# EAGLE design led-heart (EAGLE 9.1.3)
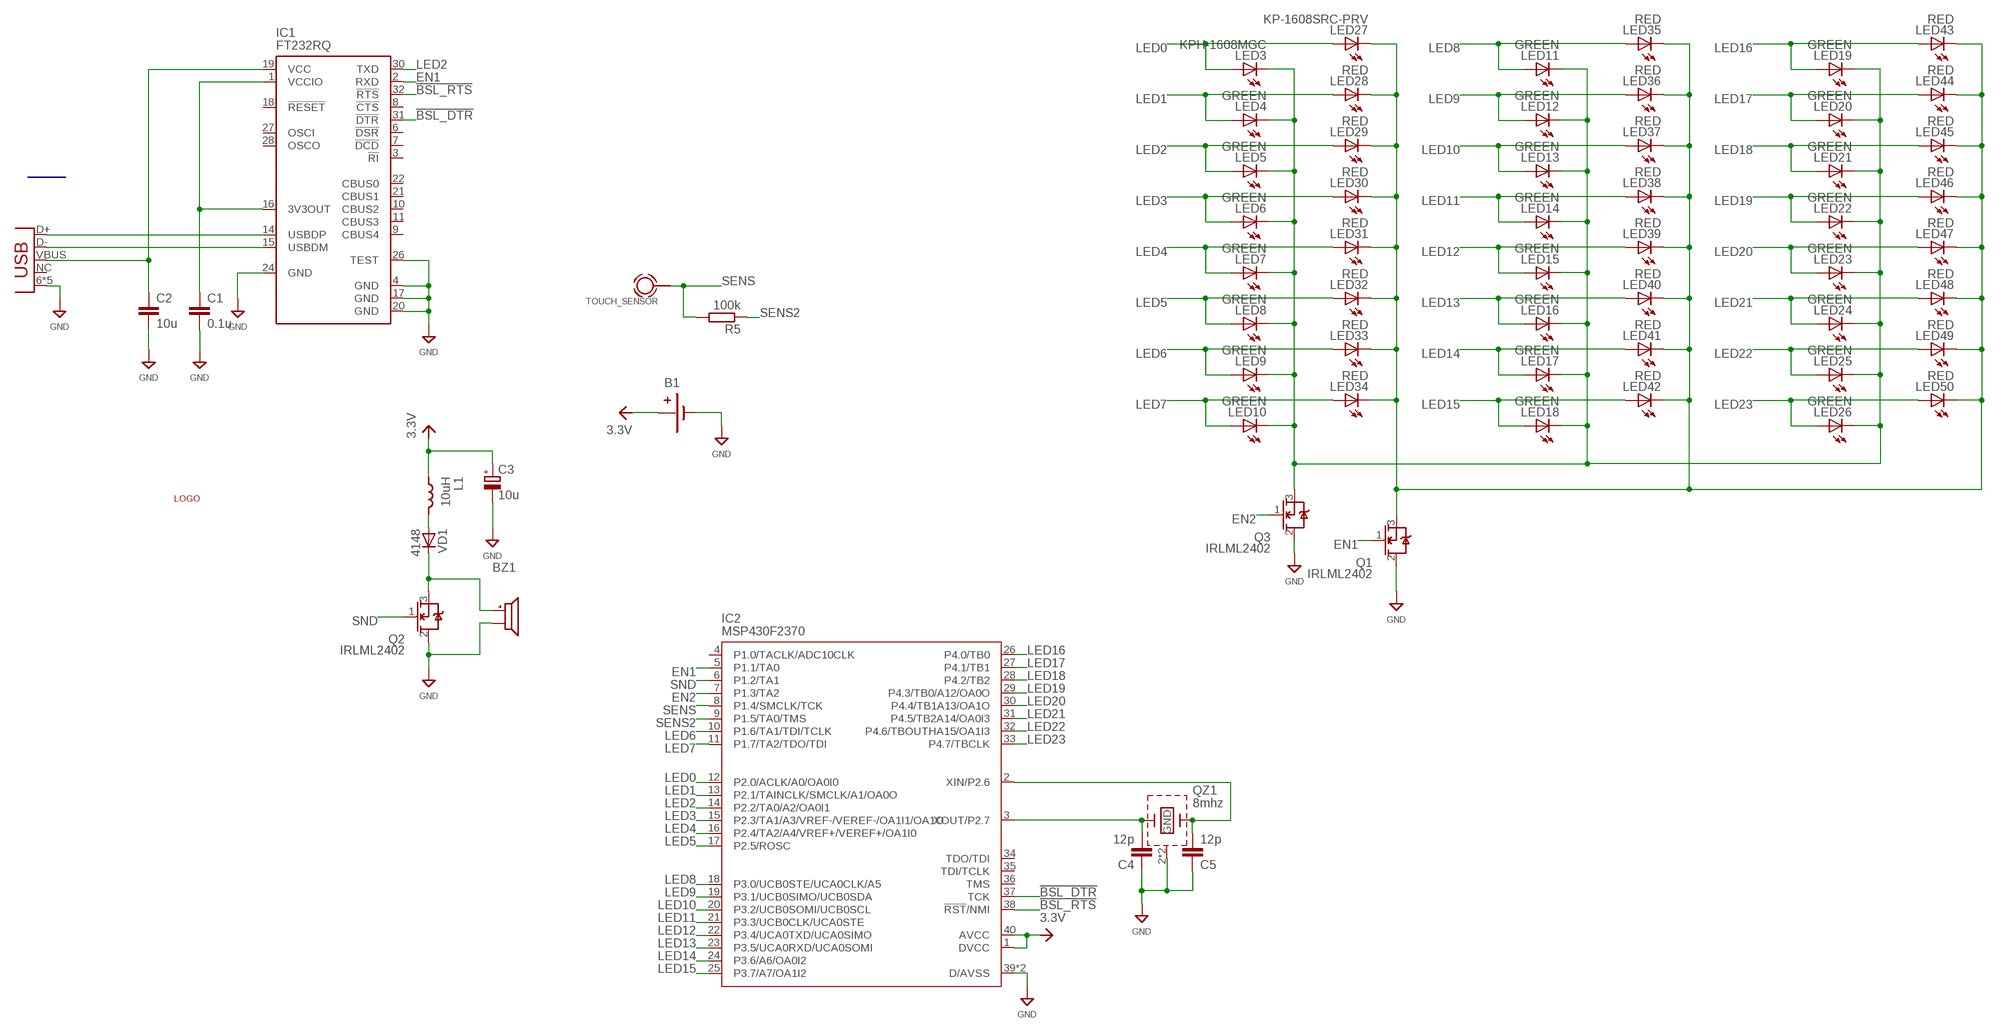
[diagram p0: schematic, sheet 1]

## Parts
B1  CR2032  [CR2032]
BZ1  BUZZERHYG2575  [HYG7525]
C1  0.1u  CAP0402  [R0402]
C2  10u  CAP0603  [R0603]
C3  10u  CPOL-EUSMCA  [SMC_A]
C4  12p  CAP0402  [R0402]
C5  12p  CAP0402  [R0402]
IC1  FT232RQ  [QFN32]
IC2  MSP430F2370  [QFN40-6X6]
L1  10uH  L-1812  [C1812]
LED3  KPH-1608MGC  LED0603  [LED0603]
LED4  GREEN  LED0603  [LED0603]
LED5  GREEN  LED0603  [LED0603]
LED6  GREEN  LED0603  [LED0603]
LED7  GREEN  LED0603  [LED0603]
LED8  GREEN  LED0603  [LED0603]
LED9  GREEN  LED0603  [LED0603]
LED10  GREEN  LED0603  [LED0603]
LED11  GREEN  LED0603  [LED0603]
LED12  GREEN  LED0603  [LED0603]
LED13  GREEN  LED0603  [LED0603]
LED14  GREEN  LED0603  [LED0603]
LED15  GREEN  LED0603  [LED0603]
LED16  GREEN  LED0603  [LED0603]
LED17  GREEN  LED0603  [LED0603]
LED18  GREEN  LED0603  [LED0603]
LED19  GREEN  LED0603  [LED0603]
LED20  GREEN  LED0603  [LED0603]
LED21  GREEN  LED0603  [LED0603]
LED22  GREEN  LED0603  [LED0603]
LED23  GREEN  LED0603  [LED0603]
LED24  GREEN  LED0603  [LED0603]
LED25  GREEN  LED0603  [LED0603]
LED26  GREEN  LED0603  [LED0603]
LED27  KP-1608SRC-PRV  LED0603  [LED0603]
LED28  RED  LED0603  [LED0603]
LED29  RED  LED0603  [LED0603]
LED30  RED  LED0603  [LED0603]
LED31  RED  LED0603  [LED0603]
LED32  RED  LED0603  [LED0603]
LED33  RED  LED0603  [LED0603]
LED34  RED  LED0603  [LED0603]
LED35  RED  LED0603  [LED0603]
LED36  RED  LED0603  [LED0603]
LED37  RED  LED0603  [LED0603]
LED38  RED  LED0603  [LED0603]
LED39  RED  LED0603  [LED0603]
LED40  RED  LED0603  [LED0603]
LED41  RED  LED0603  [LED0603]
LED42  RED  LED0603  [LED0603]
LED43  RED  LED0603  [LED0603]
LED44  RED  LED0603  [LED0603]
LED45  RED  LED0603  [LED0603]
LED46  RED  LED0603  [LED0603]
LED47  RED  LED0603  [LED0603]
LED48  RED  LED0603  [LED0603]
LED49  RED  LED0603  [LED0603]
LED50  RED  LED0603  [LED0603]
LOGO1  LOGO2  [LOGO2]
Q1  IRLML2402  MOSFET_NSOT23  [SOT23]
Q2  IRLML2402  MOSFET_NSOT23  [SOT23]
Q3  IRLML2402  MOSFET_NSOT23  [SOT23]
QZ1  8mhz  QUARTZ_GND3225  [3225]
R5  100k  RESR0402  [R0402]
U$1  TOUCH_SENSOR  [TOUCH_SENSOR]
VD1  4148  DIODE-SOD123  [SOD123]
X1  USBMICRO_B  [USB_MICROB]

## Nets
3.3V: B1.PLUS C3.+ IC2.1(DVCC) IC2.40(AVCC) L1.1
5V: C2.1 IC1.19(VCC) X1.VBUS
!BSL_DTR: IC1.31(!DTR) IC2.37(TCK)
!BSL_RTS: IC1.32(!RTS) IC2.38(!RST!/NMI)
BOOST: L1.2 VD1.A
EN1: IC1.2(RXD) IC2.5(P1.1/TA0) Q1.1(G)
EN2: IC2.7(P1.3/TA2) Q3.1(G)
GND: B1.MINUS BZ1.2(M) C1.2 C2.2 C3.- C4.1 C5.1 IC1.4(GND) IC1.17(GND) IC1.20(GND) IC1.24(GND) IC1.26(TEST) IC2.39(D/AVSS) IC2.EXP(D/AVSS) Q1.2(S) Q2.2(S) Q3.2(S) QZ1.2(GND) QZ1.4(GND) X1.6(GND) X1.7(GND) X1.8(GND) X1.9(GND) X1.GND
LED0: IC2.12(P2.0/ACLK/A0/OA0I0) LED3.A LED27.A
LED1: IC2.13(P2.1/TAINCLK/SMCLK/A1/OA0O) LED4.A LED28.A
LED2: IC1.30(TXD) IC2.14(P2.2/TA0/A2/OA0I1) LED5.A LED29.A
LED3: IC2.15(P2.3/TA1/A3/VREF-/VEREF-/OA1I1/OA1O) LED6.A LED30.A
LED4: IC2.16(P2.4/TA2/A4/VREF+/VEREF+/OA1I0) LED7.A LED31.A
LED5: IC2.17(P2.5/ROSC) LED8.A LED32.A
LED6: IC2.10(P1.6/TA1/TDI/TCLK) LED9.A LED33.A
LED7: IC2.11(P1.7/TA2/TDO/TDI) LED10.A LED34.A
LED8: IC2.18(P3.0/UCB0STE/UCA0CLK/A5) LED11.A LED35.A
LED9: IC2.19(P3.1/UCB0SIMO/UCB0SDA) LED12.A LED36.A
LED10: IC2.20(P3.2/UCB0SOMI/UCB0SCL) LED13.A LED37.A
LED11: IC2.21(P3.3/UCB0CLK/UCA0STE) LED14.A LED38.A
LED12: IC2.22(P3.4/UCA0TXD/UCA0SIMO) LED15.A LED39.A
LED13: IC2.23(P3.5/UCA0RXD/UCA0SOMI) LED16.A LED40.A
LED14: IC2.24(P3.6/A6/OA0I2) LED17.A LED41.A
LED15: IC2.25(P3.7/A7/OA1I2) LED18.A LED42.A
LED16: IC2.26(P4.0/TB0) LED19.A LED43.A
LED17: IC2.27(P4.1/TB1) LED20.A LED44.A
LED18: IC2.28(P4.2/TB2) LED21.A LED45.A
LED19: IC2.29(P4.3/TB0/A12/OA0O) LED22.A LED46.A
LED20: IC2.30(P4.4/TB1A13/OA1O) LED23.A LED47.A
LED21: IC2.31(P4.5/TB2A14/OA0I3) LED24.A LED48.A
LED22: IC2.32(P4.6/TBOUTHA15/OA1I3) LED25.A LED49.A
LED23: IC2.33(P4.7/TBCLK) LED26.A LED50.A
LINE1: LED27.C LED28.C LED29.C LED30.C LED31.C LED32.C LED33.C LED34.C LED35.C LED36.C LED37.C LED38.C LED39.C LED40.C LED41.C LED42.C LED43.C LED44.C LED45.C LED46.C LED47.C LED48.C LED49.C LED50.C Q1.3(D)
LINE2: LED3.C LED4.C LED5.C LED6.C LED7.C LED8.C LED9.C LED10.C LED11.C LED12.C LED13.C LED14.C LED15.C LED16.C LED17.C LED18.C LED19.C LED20.C LED21.C LED22.C LED23.C LED24.C LED25.C LED26.C Q3.3(D)
SENS: IC2.8(P1.4/SMCLK/TCK) R5.2 U$1.CON
SENS2: IC2.9(P1.5/TA0/TMS) R5.1
SND: IC2.6(P1.2/TA1) Q2.1(G)
USB+DP: IC1.14(USBDP) X1.D+
USB_DM: IC1.15(USBDM) X1.D-
V_SND: BZ1.1(P) Q2.3(D) VD1.C
VCCIO: C1.1 IC1.1(VCCIO) IC1.16(3V3OUT)
XIN: C5.2 IC2.2(XIN/P2.6) QZ1.1
XOUT: C4.2 IC2.3(XOUT/P2.7) QZ1.3
Unconnected: IC1.3(!RI) IC1.6(!DSR) IC1.7(!DCD) IC1.8(!CTS) IC1.9(CBUS4) IC1.10(CBUS2) IC1.11(CBUS3) IC1.18(!RESET) IC1.21(CBUS1) IC1.22(CBUS0) IC1.27(OSCI) IC1.28(OSCO) IC2.4(P1.0/TACLK/ADC10CLK) IC2.34(TDO/TDI) IC2.35(TDI/TCLK) IC2.36(TMS) X1.NC

## Buses
LED[0..7],LED[8..15],LED[16..23],EN1,EN2,BSL_RXD,BSL_TXD,!BSL_DTR,!BSL_RTS,I2C_SCL,I2C_SDA

## Library data of the parts
B1 = netcat:CR2032
BZ1 = netcat:BUZZER
C1 C2 C4 C5 = netcat:CAP
C3 = netcat:CPOL-EU
IC1 = netcat:FT232R: Source: http://www.ftdichip.com/Documents/DataSheets/DS_FT232R_v104.pdf; MPN: FT232RQ; OC_FARNELL: 1146033; OC_NEWARK: 91K9919
IC2 = netcat:MSP430F2370
L1 = netcat:L
LED3-LED50 = netcat:LED: LED OSRAM: - CHIPLED LG R971, LG N971, LY N971, LG Q971, LY Q971, LO R971, LY R971 LH N974, LH R974 LS Q976, LO Q976, LY Q976 LO Q996 - Hyper CHIPLED LW Q18S LB Q993, LB Q99A, LB R99A - SideLED LS A670, LO A670, LY A670, LG A670, LP A670 LB A673, LV A673, LT A673, LW A673 LH A674 LY A675 LS A676, LA A676, LO A676, LY A676, LW A676 LS A679, LY A679, LG A679 - Hyper Micro SIDELED® LS Y876, LA Y876, LO Y876, LY Y876 LT Y87S - SmartLED LW L88C, LW L88S LB L89C, LB L89S, LG L890 LS L89K, LO L89K, LY L89K LS L896, LA L896, LO L896, LY L896 - TOPLED LS T670, LO T670, LY T670, LG T670, LP T670 LSG T670, LSP T670, LSY T670, LOP T670, LYG T670 LG T671, LOG T671, LSG T671 LB T673, LV T673, LT T673, LW T673 LH T674 LS T676, LA T676, LO T676, LY T676, LB T676, LH T676, LSB T676, LW T676 LB T67C, LV T67C, LT T67C, LS T67K, LO T67K, LY T67K, LW E67C LS E67B, LA E67B, LO E67B, LY E67B, LB E67C, LV E67C, LT E67C LW T67C LS T679, LY T679, LG T679 LS T770, LO T770, LY T770, LG T770, LP T770 LB T773, LV T773, LT T773, LW T773 LH T774 LS E675, LA E675, LY E675, LS T675 LS T776, LA T776, LO T776, LY T776, LB T776 LHGB T686 LT T68C, LB T68C - Hyper Mini TOPLED® LB M676 - Mini TOPLED Santana® LG M470 LS M47K, LO M47K, LY M47K Source: http://www.osram.convergy.de LUXEON: - LUMILED® LXK2-PW12-R00, LXK2-PW12-S00, LXK2-PW14-U00, LXK2-PW14-V00 LXK2-PM12-R00, LXK2-PM12-S00, LXK2-PM14-U00 LXK2-PE12-Q00, LXK2-PE12-R00, LXK2-PE12-S00, LXK2-PE14-T00, LXK2-PE14-U00 LXK2-PB12-K00, LXK2-PB12-L00, LXK2-PB12-M00, LXK2-PB14-N00, LXK2-PB14-P00, LXK2-PB14-Q00 LXK2-PR12-L00, LXK2-PR12-M00, LXK2-PR14-Q00, LXK2-PR14-R00 LXK2-PD12-Q00, LXK2-PD12-R00, LXK2-PD12-S00 LXK2-PH12-R00, LXK2-PH12-S00 LXK2-PL12-P00, LXK2-PL12-Q00, LXK2-PL12-R00 Source: www.luxeon.com KINGBRIGHT: KA-3528ASYC Source: www.kingbright.com
LOGO1 = netcat:LOGO
Q1-Q3 = netcat:MOSFET_N
QZ1 = netcat:QUARTZ_GND
R5 = netcat:RES
U$1 = netcat:TOUCH_SENSOR
VD1 = netcat:DIODE
X1 = netcat:USB: USB Connectors USB-B-PTH is fully proven SKU : PRT-00139 USB-miniB is fully proven SKU : PRT-00587 USB-A-PCB is untested. USB-A-H is throughly reviewed, but untested. Spark Fun Electronics SKU : PRT-00437 USB-B-SMT is throughly reviewed, but untested. Needs silkscreen touching up. USB-A-S has not been used/tested USB-MB-H has not been used/tested

## Board
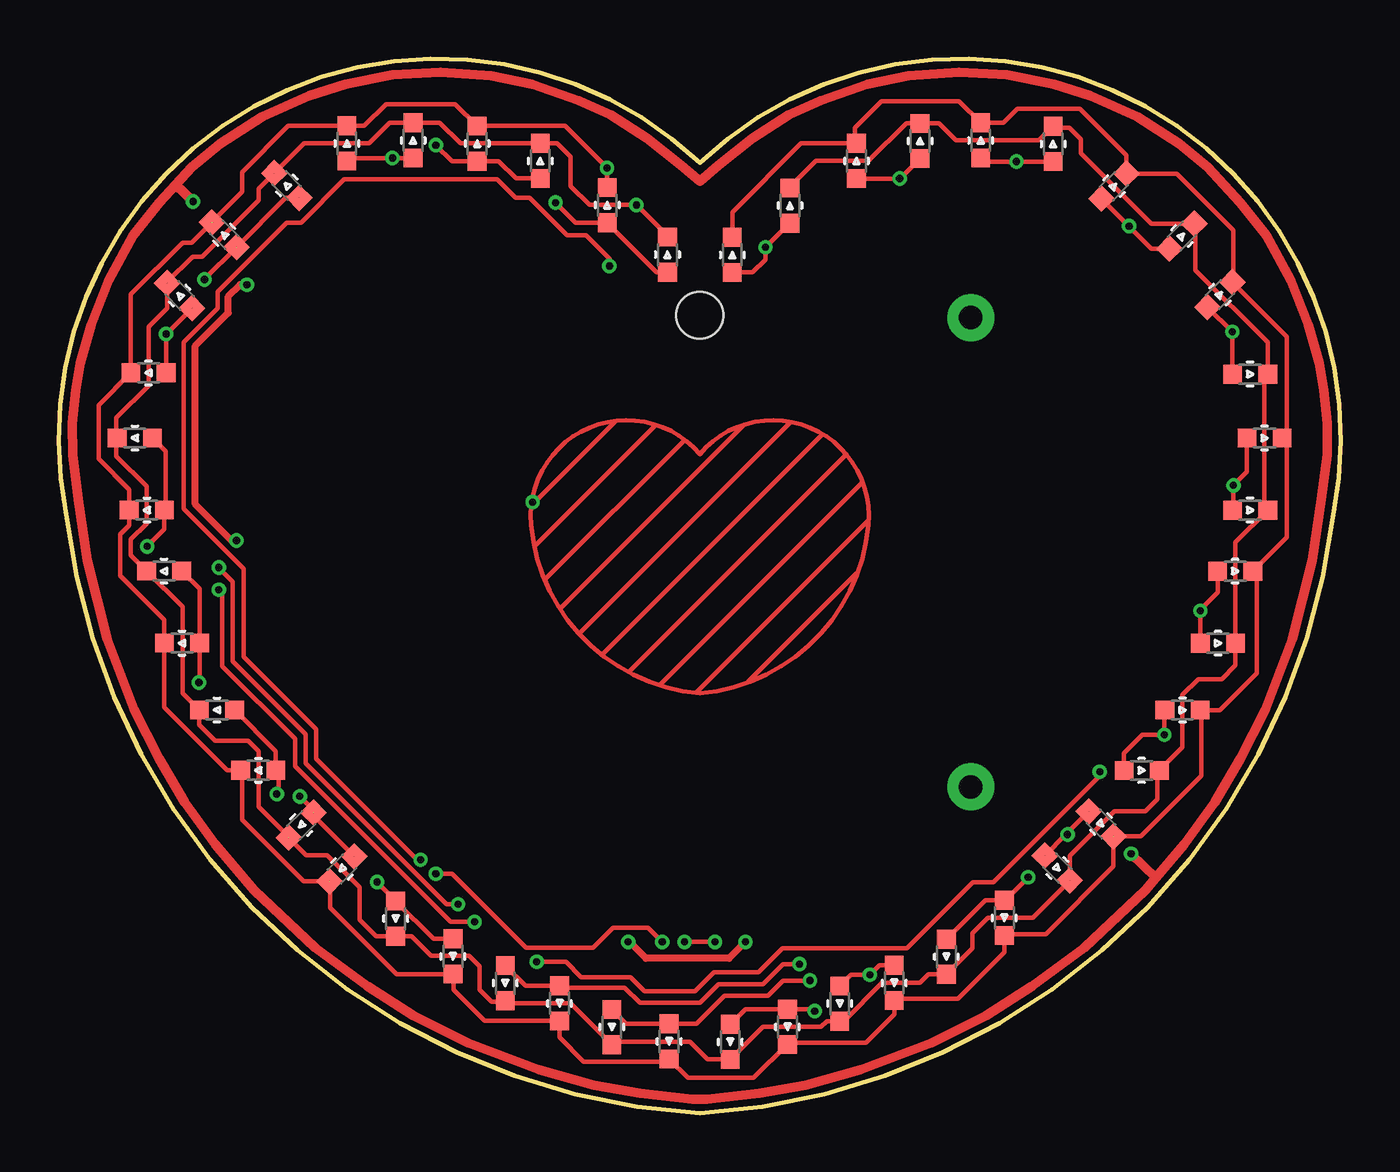
[diagram p1: board, top side]
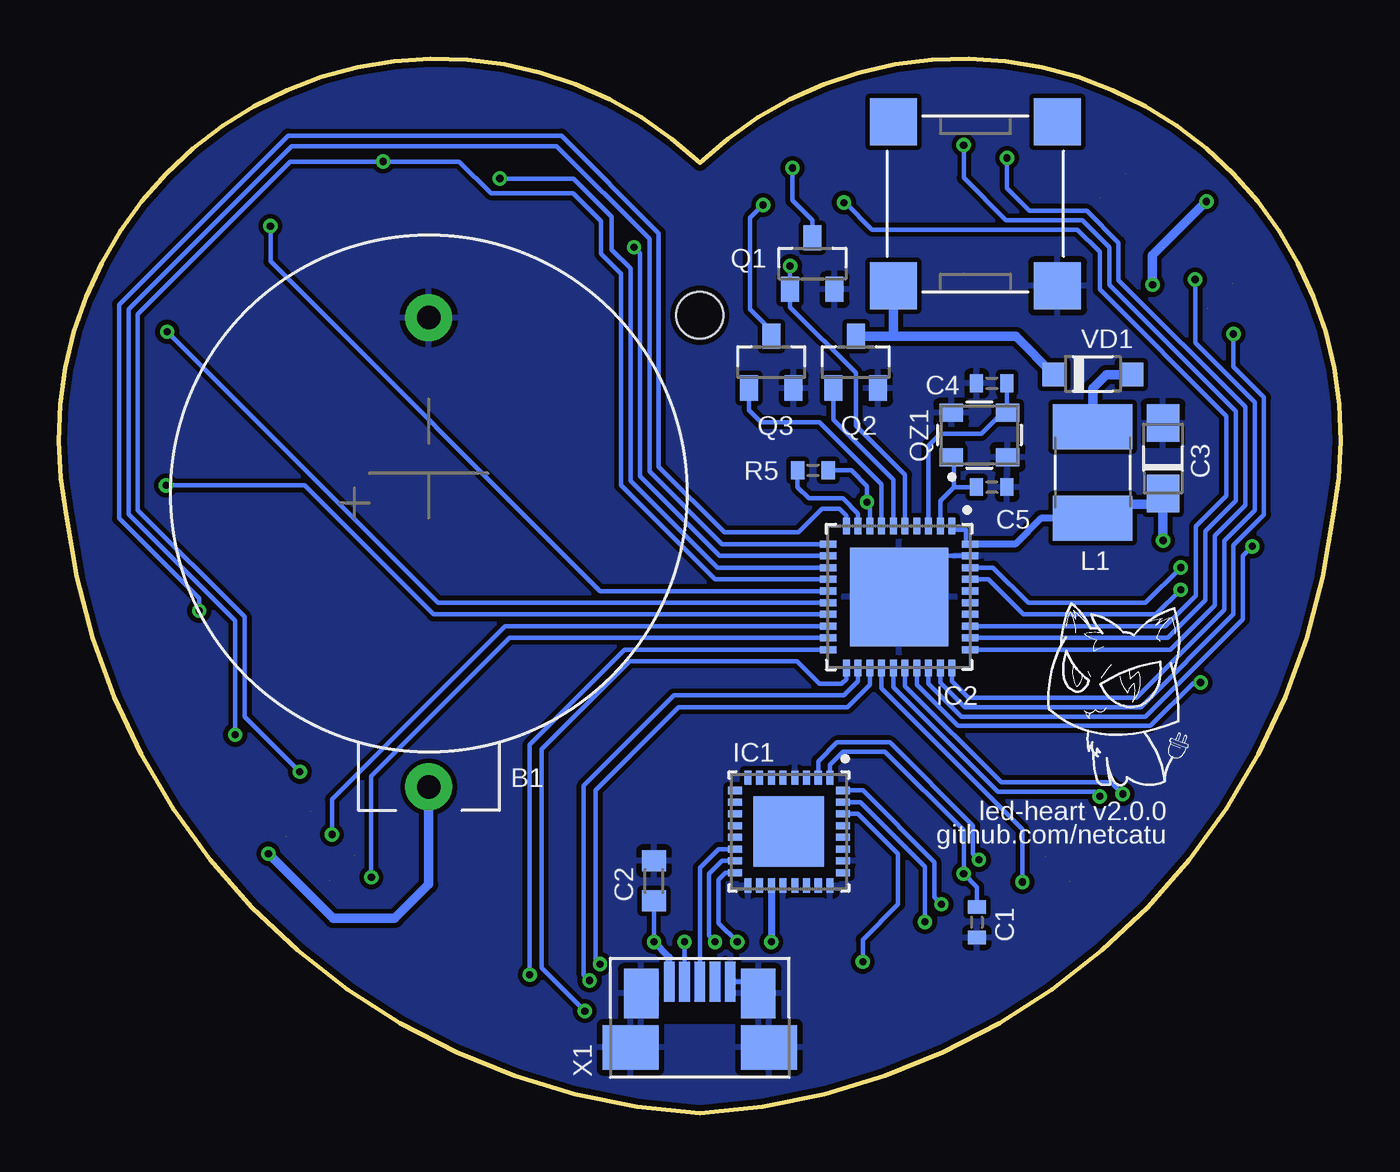
[diagram p2: board, bottom side, seen from below]

Size 54.66 x 44.93 mm. Coordinates in mm from the lower left corner, seen from the top.
Outline: 54.33,25.5 arc145 27.33,40.5 arc145 0.33,25.5 arc80 27.33,0 arc80 54.33,25.5
Copper layers (1*16): Top 0.035mm / dielectric 1.5mm / Bottom 0.035mm
Design rules "dirt_cheap_dirty_boards.v1": minimum track width 5mil, minimum drill 12mil, track to track 5mil, track to pad 5mil, pad to pad 5mil, via to via 5mil, smd to smd 0mil, copper to edge 10mil, drill to drill 10mil, minimum pad ring 10mil, minimum via ring 6mil, stop-mask expansion 2mil, vias tented up to drill 25mil, thermal gap 10mil
Holes 2 mm at 27.33,34

### Footprints (pad centres in the part's own frame; a part is rotated, then mirrored left to right if it is on the bottom)
CR2032 = drill 1 pad 2: MINUS -6,0; PLUS 14,0
HYG7525 = smd 2 x 2: 1 -3.5,3.5; 2 -3.5,-3.5; 3 3.5,-3.5; 4 3.5,3.5
R0402 = smd 0.559 x 0.762: 1 -0.65,0; 2 0.65,0
R0603 = smd 0.889 x 1.016: 1 -0.85,0; 2 0.85,0
SMC_A = smd 1.6 x 1.4: + -1.5,0; - 1.5,0
QFN32 = smd 0.6 x 0.3: 1 -2.3,1.75; 2 -2.3,1.25; 3 -2.3,0.75; 4 -2.3,0.25; 5 -2.3,-0.25; 6 -2.3,-0.75; 7 -2.3,-1.25; 8 -2.3,-1.75; 17 2.3,-1.75; 18 2.3,-1.25; 19 2.3,-0.75; 20 2.3,-0.25; 21 2.3,0.25; 22 2.3,0.75; 23 2.3,1.25; 24 2.3,1.75 | smd 0.3 x 0.6: 9 -1.75,-2.3; 10 -1.25,-2.3; 11 -0.75,-2.3; 12 -0.25,-2.3; 13 0.25,-2.3; 14 0.75,-2.3; 15 1.25,-2.3; 16 1.75,-2.3; 25 1.75,2.3; 26 1.25,2.3; 27 0.75,2.3; 28 0.25,2.3; 29 -0.25,2.3; 30 -0.75,2.3; 31 -1.25,2.3; 32 -1.75,2.3 | smd 3 x 3: EXP 0,0
QFN40-6X6 = smd 0.7 x 0.3: 1 -3.025,2.25; 2 -3.025,1.75; 3 -3.025,1.25; 4 -3.025,0.75; 5 -3.025,0.25; 6 -3.025,-0.25; 7 -3.025,-0.75; 8 -3.025,-1.25; 9 -3.025,-1.75; 10 -3.025,-2.25; 21 3.025,-2.25; 22 3.025,-1.75; 23 3.025,-1.25; 24 3.025,-0.75; 25 3.025,-0.25; 26 3.025,0.25; 27 3.025,0.75; 28 3.025,1.25; 29 3.025,1.75; 30 3.025,2.25 | smd 0.3 x 0.7: 11 -2.25,-3.025; 12 -1.75,-3.025; 13 -1.25,-3.025; 14 -0.75,-3.025; 15 -0.25,-3.025; 16 0.25,-3.025; 17 0.75,-3.025; 18 1.25,-3.025; 19 1.75,-3.025; 20 2.25,-3.025; 31 2.25,3.025; 32 1.75,3.025; 33 1.25,3.025; 34 0.75,3.025; 35 0.25,3.025; 36 -0.25,3.025; 37 -0.75,3.025; 38 -1.25,3.025; 39 -1.75,3.025; 40 -2.25,3.025 | smd 4.2 x 4.2: EXP 0,0
C1812 = smd 1.9 x 3.4: 1 -1.95,0; 2 1.95,0
LED0603 = smd 0.8 x 0.8: A 0,-0.75; C 0,0.75
SOT23 = smd 0.762 x 1.067: 1 -0.95,-1.1; 2 0.95,-1.1; 3 0,1.1
3225 = smd 1.016 x 0.762: 1 -1.28,-0.948; 2 1.121,-0.948; 3 1.121,0.948; 4 -1.28,0.948
TOUCH_SENSOR = smd 0.2 x 0.2: CON -7.128,2.337
SOD123 = smd 1.016 x 1.016: A 1.646,-0.025; C -1.646,-0.025
USB_MICROB = smd 2.1 x 1.475: 6 2.3,-2.5; 8 2.3,2.5 | smd 1.9 x 2.375: 7 0,-2.95; 9 0,2.95 | smd 1.7 x 0.45: D+ 2.8,0; D- 2.8,0.65; GND 2.8,-1.3; NC 2.8,-0.65; VBUS 2.8,1.3

### Placement (x,y rotation side)
B1  38.88,27.9 270 bottom
BZ1  15.58,38.75 90 bottom
C1  15.51,8.14 270 bottom
C2  29.28,9.9 90 bottom
C3  7.58,27.9 90 bottom
C4  14.88,31.1 0 bottom
C5  14.88,26.68 180 bottom
IC1  23.53,12 270 bottom
IC2  18.83,22 270 bottom
L1  10.58,27.3 90 bottom
LED3  31.17,38.67 0 top
LED4  36.72,41.42 0 top
LED5  42.39,41.3 0 top
LED6  47.88,37.37 315 top
LED7  50.79,31.49 270 top
LED8  50.79,25.7 270 top
LED9  49.41,20.02 270 top
LED10  46.16,14.61 270 top
LED11  42.57,10.45 225 top
LED12  37.84,6.66 180 top
LED13  33.3,4.66 180 top
LED14  28.63,3.04 180 top
LED15  23.58,3.66 180 top
LED16  19.04,5.54 180 top
LED17  14.37,8.29 180 top
LED18  10.34,12.27 135 top
LED19  6.75,17.18 90 top
LED20  4.5,23.1 90 top
LED21  3.25,28.77 90 top
LED22  5.16,34.84 45 top
LED23  9.72,39.53 45 top
LED24  15.11,41.45 0 top
LED25  20.53,40.58 0 top
LED26  25.95,36.58 0 top
LED27  28.71,36.58 0 top
LED28  34.01,40.58 0 top
LED29  39.3,41.45 0 top
LED30  44.98,39.5 315 top
LED31  49.5,34.88 315 top
LED32  51.4,28.77 270 top
LED33  50.15,23.09 270 top
LED34  47.9,17.18 270 top
LED35  44.44,12.33 225 top
LED36  40.31,8.32 180 top
LED37  35.62,5.55 180 top
LED38  31.07,3.68 180 top
LED39  26.02,3.05 180 top
LED40  21.35,4.68 180 top
LED41  16.81,6.68 180 top
LED42  12.07,10.41 135 top
LED43  8.51,14.61 90 top
LED44  5.26,20.03 90 top
LED45  3.76,25.7 90 top
LED46  3.83,31.55 90 top
LED47  7.06,37.43 45 top
LED48  12.29,41.32 0 top
LED49  17.84,41.31 0 top
LED50  23.38,38.69 0 top
LOGO1  9.48,17.85 0 bottom
Q1  22.53,36.2 0 bottom
Q2  20.68,32 0 bottom
Q3  24.28,32 0 bottom
QZ1  15.33,28.9 0 bottom
R5  22.5,27.39 0 bottom
U$1  27.33,23.7 0 top
VD1  10.58,31.5 0 bottom
X1  27.33,2.8 90 bottom

### Tracks (layer width: path | path; a pad name or v marks a point on that pad's centre or on a via)
3.3V  (via drill 0.3)
  Top 0.305: v7.58,24.4 7.38,24.4 5.83,25.95 5.83,32.7 7.23,34.1 7.23,34.8 7.73,35.3 v8.03,35.3
  Top 0.406: 46.76,10.03 46.33,9.5 43.73,7.05 41.48,5.4 39.53,4.15 37.23,3 34.18,1.85 31.83,1.2 29.88,0.85 27.63,0.6 27.03,0.6 24.78,0.85 22.83,1.2 20.48,1.85 17.43,3 15.13,4.15 13.18,5.4 10.93,7.05 8.33,9.5 6.68,11.45 5.38,13.25 4.28,15.1 3.23,17.2 2.08,20.2 1.23,23.55 0.83,26.15 0.6,28.05 0.58,29.4 0.73,30.8 0.93,31.95 1.38,33.6 2.13,35.5 3.18,37.4 4.28,38.8 4.99,39.56 | 46.76,10.03 47.98,11.45 49.28,13.25 50.38,15.1 51.43,17.2 52.58,20.2 53.43,23.55 53.83,26.15 54.08,28.05 54.08,29.4 53.93,30.8 53.73,31.95 53.28,33.6 52.53,35.5 51.48,37.4 50.38,38.8 48.98,40.3 47.78,41.3 45.98,42.45 43.98,43.35 42.43,43.85 40.43,44.25 38.38,44.35 36.23,44.2 34.48,43.85 32.48,43.15 31.13,42.55 29.58,41.55 28.13,40.4 27.33,39.7 26.53,40.4 25.08,41.55 23.53,42.55 22.18,43.15 20.18,43.85 18.43,44.2 16.28,44.35 14.23,44.25 12.23,43.85 10.68,43.35 8.68,42.45 6.88,41.3 5.68,40.3 4.99,39.56 | v45.71,11.05 46.76,10.03 | v5.73,38.85 4.99,39.56
  Bottom 0.2: IC2.1 16.58,24.85 15.98,24.85 15.98,24.25 IC2.40
  Bottom 0.305: L1.1 12.78,25.35 13.88,24.25 IC2.40
  Bottom 0.406: v45.71,11.05 42.96,8.3 40.33,8.3 38.88,9.75 B1.PLUS | v8.03,35.3 8.03,36.55 v5.73,38.85 | L1.1 9.83,25.35 9.23,25.95 8.03,25.95 C3.+ v7.58,24.4
5V  (via drill 0.3)
  Top 0.2: 24.33,7.3 v24.28,7.3
  Top 0.305: v29.28,7.3 28.58,6.6 25.03,6.6 24.33,7.3
  Bottom 0.2: v29.28,7.3 C2.1
  Bottom 0.305: X1.VBUS 28.63,6.65 v29.28,7.3 | IC1.19 v24.28,7.3
!BSL_DTR  (via drill 0.3)
  Top 0.2: v6.83,22.3 6.98,22.15 6.98,19.05 10.08,15.95 10.08,14.77 16.7,8.15 v17.73,8.15
  Bottom 0.2: IC1.31 20.48,13.25 17.73,10.5 v17.73,8.15 | IC2.37 15.03,22.75 13.53,21.25 7.88,21.25 v6.83,22.3
!BSL_RTS  (via drill 0.3)
  Top 0.2: v6.83,23.25 7.43,22.65 7.43,19.25 10.53,16.15 10.53,14.9 16.53,8.9 v17.03,8.9
  Bottom 0.2: IC1.32 20.38,13.75 17.33,10.7 17.33,9.2 v17.03,8.9 | IC2.38 14.83,23.25 13.33,21.75 8.33,21.75 v6.83,23.25
BOOST
  Bottom 0.406: VD1.A 10,31.48 10.58,30.9 L1.2
EN1  (via drill 0.3)
  Top 0.2: v15.43,10.8 15.28,10.8 10.98,15.1 10.98,16.35 7.88,19.45 7.88,23.2 5.33,25.75 5.33,32.85 6.78,34.3 6.78,35 9.73,37.95 10.33,37.95 12.18,39.8 18.68,39.8 19.48,39 20.08,39 21.68,37.4 22.48,37.4 23.48,36.4 v23.48,36.1
  Bottom 0.2: v15.43,10.8 15.68,11.05 15.68,12.25 19.23,15.8 21.48,15.8 22.28,15 IC1.2 | v23.48,36.1 Q1.1 23.48,34.35 20.68,31.55 20.68,29.3 18.58,27.2 IC2.5
EN2
  Bottom 0.2: Q3.1 25.23,29.95 24.73,29.45 22.23,29.45 19.58,26.8 IC2.7
GND
  Bottom 0.2: X1.GND 25.33,5.6 X1.6 | IC2.39 17.08,23.75 IC2.EXP
  pour Bottom (isolate 0.2): 27.33,-0.5 -0.67,-0.5 -0.67,45.5 55.33,45.5 55.33,-0.5
LED0  (via drill 0.3)
  Top 0.2: 31.2,37.9 LED3.A 31.15,37.92 v30.13,36.9 30.13,36.38 29.58,35.83 LED27.A
  Bottom 0.2: IC2.12 26.48,23.75 29.88,27.15 29.88,36.65 v30.13,36.9
LED1  (via drill 0.3)
  Top 0.2: LED28.A v35.85,39.83 v35.87,39.83 LED4.A
  Bottom 0.2: v35.85,39.83 32.7,39.83 31.08,38.2 31.08,36.8 30.28,36 30.28,26.95 26.58,23.25 IC2.13
LED2  (via drill 0.3)
  Top 0.2: 39.33,40.67 LED29.A 39.45,40.55 v40.83,40.55 LED5.A | v20.38,6.45 21.63,6.45 22.28,5.8 24.38,5.8 24.98,5.2 27.13,5.2 27.93,6 29.83,6 30.85,7.02 36.15,7.02 38.98,9.85 39.85,9.85 44.38,14.38 v44.38,14.55
  Bottom 0.2: v44.38,14.55 46.73,16.9 46.73,21.15 51.28,25.7 51.28,34.05 44.78,40.55 v40.83,40.55 37.58,40.55 36.23,39.2 32.73,39.2 31.53,38 31.53,36.62 30.68,35.77 30.68,26.75 26.68,22.75 IC2.14 | IC1.30 20.58,12.75 18.88,11.05 18.88,8.9 20.38,7.4 v20.38,6.45
LED3  (via drill 0.3)
  Top 0.2: LED6.A 46.59,36.84 v45.63,37.8 v45.62,37.8 LED30.A
  Bottom 0.2: v45.63,37.8 45.63,36.3 31.58,22.25 IC2.15
LED4  (via drill 0.3)
  Top 0.2: 50.04,33.28 LED7.A v50.03,33.3 v50.02,33.3 LED31.A
  Bottom 0.2: v50.03,33.3 38.48,21.75 IC2.16
LED5  (via drill 0.3)
  Top 0.2: LED8.A 50.08,25.73 v50.08,26.75 50.65,27.32 LED32.A
  Bottom 0.2: v50.08,26.75 44.18,26.75 38.68,21.25 IC2.17
LED6  (via drill 0.3)
  Top 0.2: LED9.A v48.66,21.41 48.66,21.46 49.4,22.2 LED33.A | LED33.A 49.31,23 | 49.4,23 LED33.A
  Bottom 0.2: v48.66,21.41 48.66,21.94 52.08,25.35 52.08,34.45 44.88,41.65 33.23,41.65 29.08,37.5 29.08,27.55 26.28,24.75 23.13,24.75 22.13,25.75 21.38,25.75 21.08,25.45 IC2.10
LED7  (via drill 0.3)
  Top 0.2: 47.08,17.25 LED34.A | LED34.A 47.1,17.12 | LED34.A 47.13,17.15 v47.13,16.12 46.2,16.12 45.41,15.34 LED10.A
  Bottom 0.2: v47.13,16.12 47.13,20.98 51.68,25.52 51.68,34.25 44.73,41.2 33.43,41.2 29.48,37.25 29.48,27.35 26.38,24.25 IC2.11 21.88,24.27
LED8  (via drill 0.3)  (2 unrouted)
  Top 0.2: 42.94,11.88 LED11.A | 42.94,11.88 v43,11.88 | LED35.A 42.94,11.89 42.94,11.88
  Bottom 0.2: v43,11.88 43,13.38 35.63,20.75 IC2.18
LED9  (via drill 0.3)
  Top 0.2: LED12.A 39.5,9.07 LED36.A 40.33,9.09 40.37,9.09 v41.33,10.05
  Bottom 0.2: IC2.19 35.43,20.25 41.33,14.35 v41.33,10.05
LED10  (via drill 0.3)
  Top 0.2: LED13.A 33.78,5.9 v34.58,5.9 34.98,6.3 LED37.A
  Bottom 0.2: v34.58,5.9 34.58,15.7 30.53,19.75 IC2.20
LED11  (via drill 0.3)
  Top 0.2: LED14.A 29.27,4.43 LED38.A 32.16,4.43 v32.23,4.35
  Bottom 0.2: v32.23,4.35 34.08,6.2 34.08,15.5 30.33,19.25 23.18,19.25 22.23,18.3 21.28,18.3 21.08,18.5 IC2.21
LED12  (via drill 0.3)
  Top 0.2: LED15.A 24.19,3.8 LED39.A 27.18,3.8 28.38,5 30.23,5 30.88,5.65 v32.03,5.65
  Bottom 0.2: IC2.22 20.58,18.4 21.18,17.8 28.43,17.8 32.28,13.95 32.28,5.9 v32.03,5.65
LED13  (via drill 0.3)
  Top 0.2: v31.58,6.35 30.88,6.35 30.03,5.5 28.13,5.5 27.33,4.7 24.78,4.7 24.13,5.35 21.43,5.35 LED40.A 19.9,5.43 LED16.A
  Bottom 0.2: IC2.23 20.08,18.25 21.03,17.3 28.23,17.3 31.78,13.75 31.78,6.55 v31.58,6.35
LED14  (via drill 0.3)
  Top 0.2: LED41.A 16.88,7.5 | LED41.A 16.86,7.38 | LED41.A 15.98,7.43 LED17.A 14.37,9.06 v13.58,9.85
  Bottom 0.2: v13.58,9.85 13.58,12.1 19.58,18.1 IC2.24
LED15  (via drill 0.3)  (2 unrouted)
  Top 0.2: v10.28,13.5 10.87,12.91 LED18.A 10.87,12.67 LED42.A
  Bottom 0.2: IC2.25 19.08,18.15 14.63,13.7 10.48,13.7 v10.28,13.5
LED16  (via drill 0.3)
  Top 0.2: LED43.A 9.37,14.5 9.37,13.67 v9.3,13.6 | 9.33,14.68 LED43.A | LED43.A 9.26,15.42 LED19.A
  Bottom 0.2: v9.3,13.6 9.8,14.1 14.48,14.1 18.58,18.2 IC2.26
LED17  (via drill 0.3)
  Top 0.2: LED44.A 6.01,22.34 LED20.A | LED44.A 6.03,20.01 | LED44.A 6.01,18.38 v5.98,18.35
  Bottom 0.2: IC2.27 18.08,18.25 16.33,16.5 8.13,16.5 6.28,18.35 v5.98,18.35
LED18  (via drill 0.3)
  Top 0.2: LED45.A 4.56,25.75 4.56,28.21 LED21.A | LED45.A 4.53,25.68 | LED45.A 4.51,24.88 v3.78,24.15
  Bottom 0.2: v3.78,24.15 4.18,23.75 4.18,21.05 8.33,16.9 16.18,16.9 17.58,18.3 IC2.28
LED19  (via drill 0.3)  (1 unrouted)
  Top 0.2: LED22.A v4.58,33.2 LED46.A
  Bottom 0.2: v4.58,33.2 4.58,31.8 3.28,30.5 3.28,25.5 4.58,24.2 4.58,21.25 8.53,17.3 16.03,17.3 17.08,18.35 IC2.29
LED20  (via drill 0.3)  (2 unrouted)
  Top 0.2: v6.21,35.53 LED47.A 9.69,39 LED23.A
  Bottom 0.2: v6.21,35.53 6.21,32.83 3.68,30.3 3.68,25.7 4.98,24.4 4.98,21.45 8.73,17.7 15.88,17.7 16.58,18.4 IC2.30
LED21  (via drill 0.3)
  Top 0.2: LED48.A 12.42,40.7 v14.23,40.7 LED24.A
  Bottom 0.2: IC2.31 7.28,19.75 5.38,21.65 5.38,24.6 4.08,25.9 4.08,30.1 9.48,35.5 9.48,37.1 10.83,38.45 13.28,38.45 14.23,39.4 v14.23,40.7
LED22  (via drill 0.3)
  Top 0.2: LED25.A 19.5,39.83 18.76,40.56 LED49.A 16.76,40.56 v16.08,41.25
  Bottom 0.2: IC2.32 7.38,20.25 5.78,21.85 5.78,24.8 4.48,26.1 4.48,29.9 9.88,35.3 9.88,36.9 11.03,38.05 14.28,38.05 16.08,39.85 v16.08,41.25
LED23  (via drill 0.3)
  Top 0.2: LED26.A 25.49,35.83 LED50.A 22.04,37.94 v21.18,38.8
  Bottom 0.2: v21.18,38.8 21.13,38.8 19.98,37.65 11.23,37.65 10.28,36.7 10.28,35.1 4.88,29.7 4.88,26.3 6.18,25 6.18,22.05 7.48,20.75 IC2.33
LINE1  (via drill 0.3)  (3 unrouted)
  Top 0.2: LED27.C 28.71,38.38 31.65,41.33 LED28.C 33.95,41.38 33.95,42 35.08,43.12 38.38,43.12 LED29.C 40.28,42.2 40.88,42.8 43.53,42.8 45.51,40.81 LED30.C 47.67,40.03 50.08,37.62 50.08,35.46 LED31.C 52.35,33.09 52.35,28.57 | LED46.C | 9.79,42.07 9.77,42.07 | 9.79,42.07 LED48.C 13.02,42.07 13.95,43 16.9,43 LED49.C | 17.9,42.12 LED49.C | LED49.C 21.59,42.06 v23.38,40.27 LED50.C | LED44.C 4.53,20.01 | 9.79,42.07 9.79,42.06 7.83,40.1 7.83,39.26 LED47.C 6.53,37.95 5.68,37.1 5.28,37.1 3.08,34.9 LED46.C | LED44.C 4.51,21.02 2.63,22.9 2.63,24.68 3.01,25.05 LED45.C 3.01,26.57 1.7,27.88 1.7,30.18 LED46.C | LED44.C 4.5,17.3 7.19,14.61 LED43.C 7.83,14.54 7.83,12.5 10.45,9.88 LED42.C 11.58,9.84 11.58,8.75 14.4,5.93 LED41.C 16.83,5.91 16.83,5.25 18.15,3.93 LED40.C 21.35,3.23 22.38,2.2 25.92,2.2 LED39.C 26.83,1.5 29.63,1.5 LED38.C 31.14,3 34.4,3 35.62,4.21 LED37.C 35.69,4.88 38.33,4.88 40.31,6.86 LED36.C 40.36,7.62 42.08,7.62 44.97,10.51 LED35.C 46.12,11.8 48.7,14.38 48.7,17.18 LED34.C 49.5,17.18 51.08,18.75 51.08,22.92 LED33.C 52.35,24.55 52.35,28.57 | 52.35,28.57 LED32.C
  Bottom 0.2: Q1.3 22.53,38.05 23.38,38.9 v23.38,40.27
LINE2  (via drill 0.3)  (4 unrouted)
  Top 0.2: LED3.C 31.17,39.47 32.28,40.58 34.53,40.58 36.13,42.17 LED4.C | LED4.C 37.53,42.17 38.25,41.45 41.79,41.45 LED5.C 42.44,42 43.08,42 43.58,41.5 43.58,40.9 46.57,37.9 LED6.C | LED19.C 5.95,17.14 | 6,17.2 LED19.C | LED26.C 25.95,37.38 v24.63,38.7 22.63,38.7 21.83,39.5 21.83,40.75 21.25,41.33 LED25.C 17.12,41.33 16.25,42.2 LED24.C 14.11,42.2 13.23,41.33 10.46,41.33 LED23.C 8.53,39.39 8.53,38.9 6.13,36.5 5.7,36.5 4.62,35.42 LED22.C 4.62,34.3 3.83,33.5 3.83,31 2.45,29.62 2.45,28.82 LED21.C 2.45,28.73 2.45,28 3.75,26.7 3.75,25.12 3.08,24.45 3.08,23.77 LED20.C 5.28,21.57 5.28,17.9 LED19.C | LED4.C 36.67,42.12 | LED19.C 6,16.55 6.68,15.88 8.08,15.88 8.53,15.43 8.53,13.05 9.81,11.77 LED18.C 10.55,11 11.45,11 12.83,9.62 12.83,8.25 13.54,7.54 LED17.C 15.04,7.54 15.88,6.7 17.5,6.7 17.95,6.25 17.95,5.25 18.45,4.75 19,4.75 LED16.C 19.15,4.68 21.82,4.68 LED15.C 23.72,3.05 26.9,3.05 27.66,2.29 LED14.C 30.01,3.68 32.5,3.68 32.74,3.91 LED13.C 33.47,3.91 35.1,5.55 36.7,5.55 37.07,5.91 LED12.C 38.95,7.02 38.95,7.68 39.6,8.32 41.53,8.32 43.1,9.9 LED11.C | LED11.C 43.1,10.97 45,12.88 46.33,12.88 46.83,13.38 46.83,14.52 LED10.C 47.9,15.59 47.9,17.82 48.58,18.5 49.58,18.5 50.16,19.09 LED9.C 50.16,24.32 LED8.C 51.4,25.7 51.4,31.49 LED7.C 51.54,32.84 48.45,35.92 48.45,37.86 LED6.C | LED11.C | LED6.C
  Bottom 0.2: Q3.3 24.28,33.35 25.18,34.25 25.18,38.15 v24.63,38.7
SENS  (via drill 0.3)
  Bottom 0.2: R5.2 20.87,27.39 20.2,26.72 U$1.CON 20.08,25.91 IC2.8
  other vias: 20.2,26.04
SENS2
  Bottom 0.2: IC2.9 20.58,25.55 21.23,26.2 22.68,26.2 23.15,26.68 R5.1
SND
  Bottom 0.2: Q2.1 21.63,29.55 19.08,27 IC2.6
USB+DP
  Bottom 0.2: IC1.14 26.53,11.25 27.33,10.45 X1.D+
USB_DM  (via drill 0.3)
  Top 0.2: v27.98,7.3 v26.68,7.3
  Bottom 0.2: X1.D- v27.98,7.3 | IC1.15 26.38,10.75 26.93,10.2 26.93,7.55 v26.68,7.3
V_SND
  Bottom 0.406: Q2.3 19.08,33.1 | 19.08,33.1 13.85,33.1 VD1.C | BZ1.1 19.08,33.1
VCCIO  (via drill 0.3)
  Top 0.2: v16.08,10.2 16.78,10.2 19.93,7.05 22.78,7.05 23.63,7.9 25.13,7.9 v25.73,7.3
  Bottom 0.2: IC1.16 26.23,10.25 26.53,9.95 26.53,8.1 v25.73,7.3 | C1.1 15.51,9.64 v16.08,10.2 16.08,12.05 19.43,15.4 21.23,15.4 21.78,14.85 IC1.1
XIN
  Bottom 0.2: C5.2 16.5,26.68 | 16.5,26.68 17.08,26.1 IC2.2 | 16.5,26.68 16.5,27.84 QZ1.1
XOUT
  Bottom 0.2: C4.2 14.23,29.87 | 14.23,29.87 QZ1.3 | 14.23,29.87 14.41,29.87 15.33,28.95 17.08,28.95 17.58,28.45 IC2.3

### Text on the board
bPlace: led-heart v2.0.0 | github.com/netcatu